# Altium schematic sheet llrf_afe_pwr_ctrl.SchDoc: =GlobalProjectName
size 209 x 297 mm; SheetNumber: 12; SheetTotal: 17; PageSetup: Record=PageOptions|CenterHorizontal=True|CenterVertical=True|PrintScale=1.00|XCorrection=1.00|YCorrection=1.00|PrintKind=1|BorderSize=5000000|LeftOffset=0|BottomOffset=0|Orientation=2|PaperLength=1000|PaperWidth=1000|Scale=100|PaperSource=15|PrintQuality=1200|MediaType=1|DitherType=10|PaperKind=A3|PrintScaleMode=1; Weight: -; ScaleFactor: -
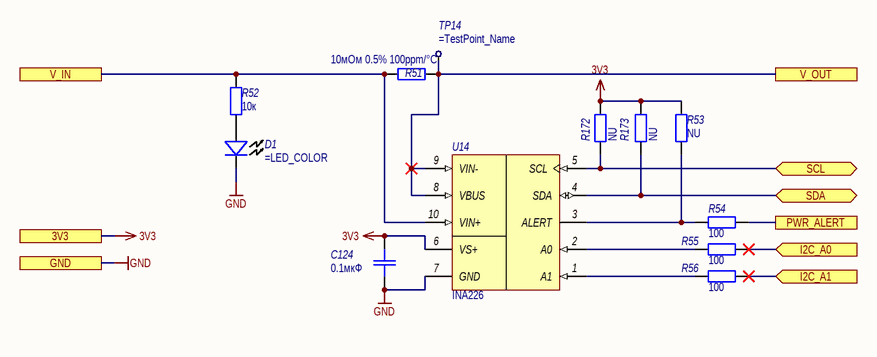
[diagram p0: llrf_afe_pwr_ctrl.SchDoc]

## Parts
C124  0.1мкФ  [SMD_C0402]
D1  LED  [LED-0805]  (value not drawn)
R51  10мОм 0.5% 100ppm/°C  [SMD_1206]
R52  10к  [SMD_0603]
R53  NU  [SMD_0603]
R54  100  [SMD_0603]
R55  100  [SMD_0603]
R56  100  [SMD_0603]
R172  NU  [SMD_0603]
R173  NU  [SMD_0603]
TP14  (no value)  [TestPoint]
U14  INA226  [VSSOP-10]

## Ports
3V3, GND, I2C_A0 (in), I2C_A1 (in), PWR_ALERT, SCL (bidir), SDA (bidir), V_IN, V_OUT

## Nets
3V3: C124.2 R53.2 R172.2 R173.2 U14.6(VS+) ; port 3V3
GND: C124.1 D1.2(K) U14.7(GND) ; port GND
I2C_A0: R55.1 ; port I2C_A0
I2C_A1: R56.1 ; port I2C_A1
PWR_ALERT: R54.1 ; port PWR_ALERT
SCL: R172.1 U14.5(SCL) ; port SCL
SDA: R173.1 U14.4(SDA) ; port SDA
V_IN: R51.2 R52.1 U14.10(VIN+) ; port V_IN
V_OUT: R51.1 TP14.0(TP) U14.8(VBUS) U14.9(VIN-) ; port V_OUT
NetD1_1: D1.1(A) R52.2
NetR53_1: R53.1 R54.2 U14.3(ALERT)
NetR55_2: R55.2 U14.2(A0)
NetR56_2: R56.2 U14.1(A1)

## Notes on the sheet
- Подп. и дата
- Инв. № дубл.
- Взам. инв. №
- Инв. № подл.
- Изм.
- Лист
- № докум.
- Подп.
- Дата
- Форма 2а ГОСТ 2.104-2006
- Копировал
- Формат А4

## Library data of the parts
C124 = Capacitor: Назначение: SMD-конденсатор; Наименование: Конденсатор; Потребление, Вт: 0; Value: 0.1мкФ
D1 = LED: Назначение: Светодиод; Наименование: SMD-LED; Потребление, Вт: 0,01; Value: =LED_COLOR
R51 = Resistor: PE1206DRM470R01L; Наименование: Резистор; Назначение: SMD-резистор; Потребление, Вт: 0,001; Value: 10мОм 0.5% 100ppm/°C
R52-R56 R172 R173 = Resistor: Наименование: Резистор; Назначение: SMD-резистор; Потребление, Вт: 0,001
  R52: Value: 10к
  R53 R172 R173: Value: NU
  R54-R56: Value: 100
TP14 = TP: Наименование: Точка проверки; Назначение: Контроль параметров платы; TP_Name: =TestPoint_Name
U14 = INA226: High- or Low-Side Measurement, Bidirectional Current and Power Monitor With I2C Interface; Назначение: High-Side or Low-Side Measurement,; Потребление, Вт: 0,001; ComponentLink1Description: Data sheet; ComponentLink1URL: http://www.ti.com/lit/ds/symlink/ina226.pdf; DataSheet: https://www.ti.com/lit/ds/symlink/ina226.pdf?ts=1592809211957&ref_url=https%253A%252F%252Fwww.google.com%252F; Наименование: INA226